# Altium schematic sheet RXMIX-T3.SchDoc
size Legal; CompanyName: Brinton Engineering, LLC; Address1: 3479 Edison Way; Address2: Menlo Park CA 94025; Address3: +1 (877) 778-8435; Address4: brintonengineering.com; Revision: 1; SheetNumber: 1; SheetTotal: 1
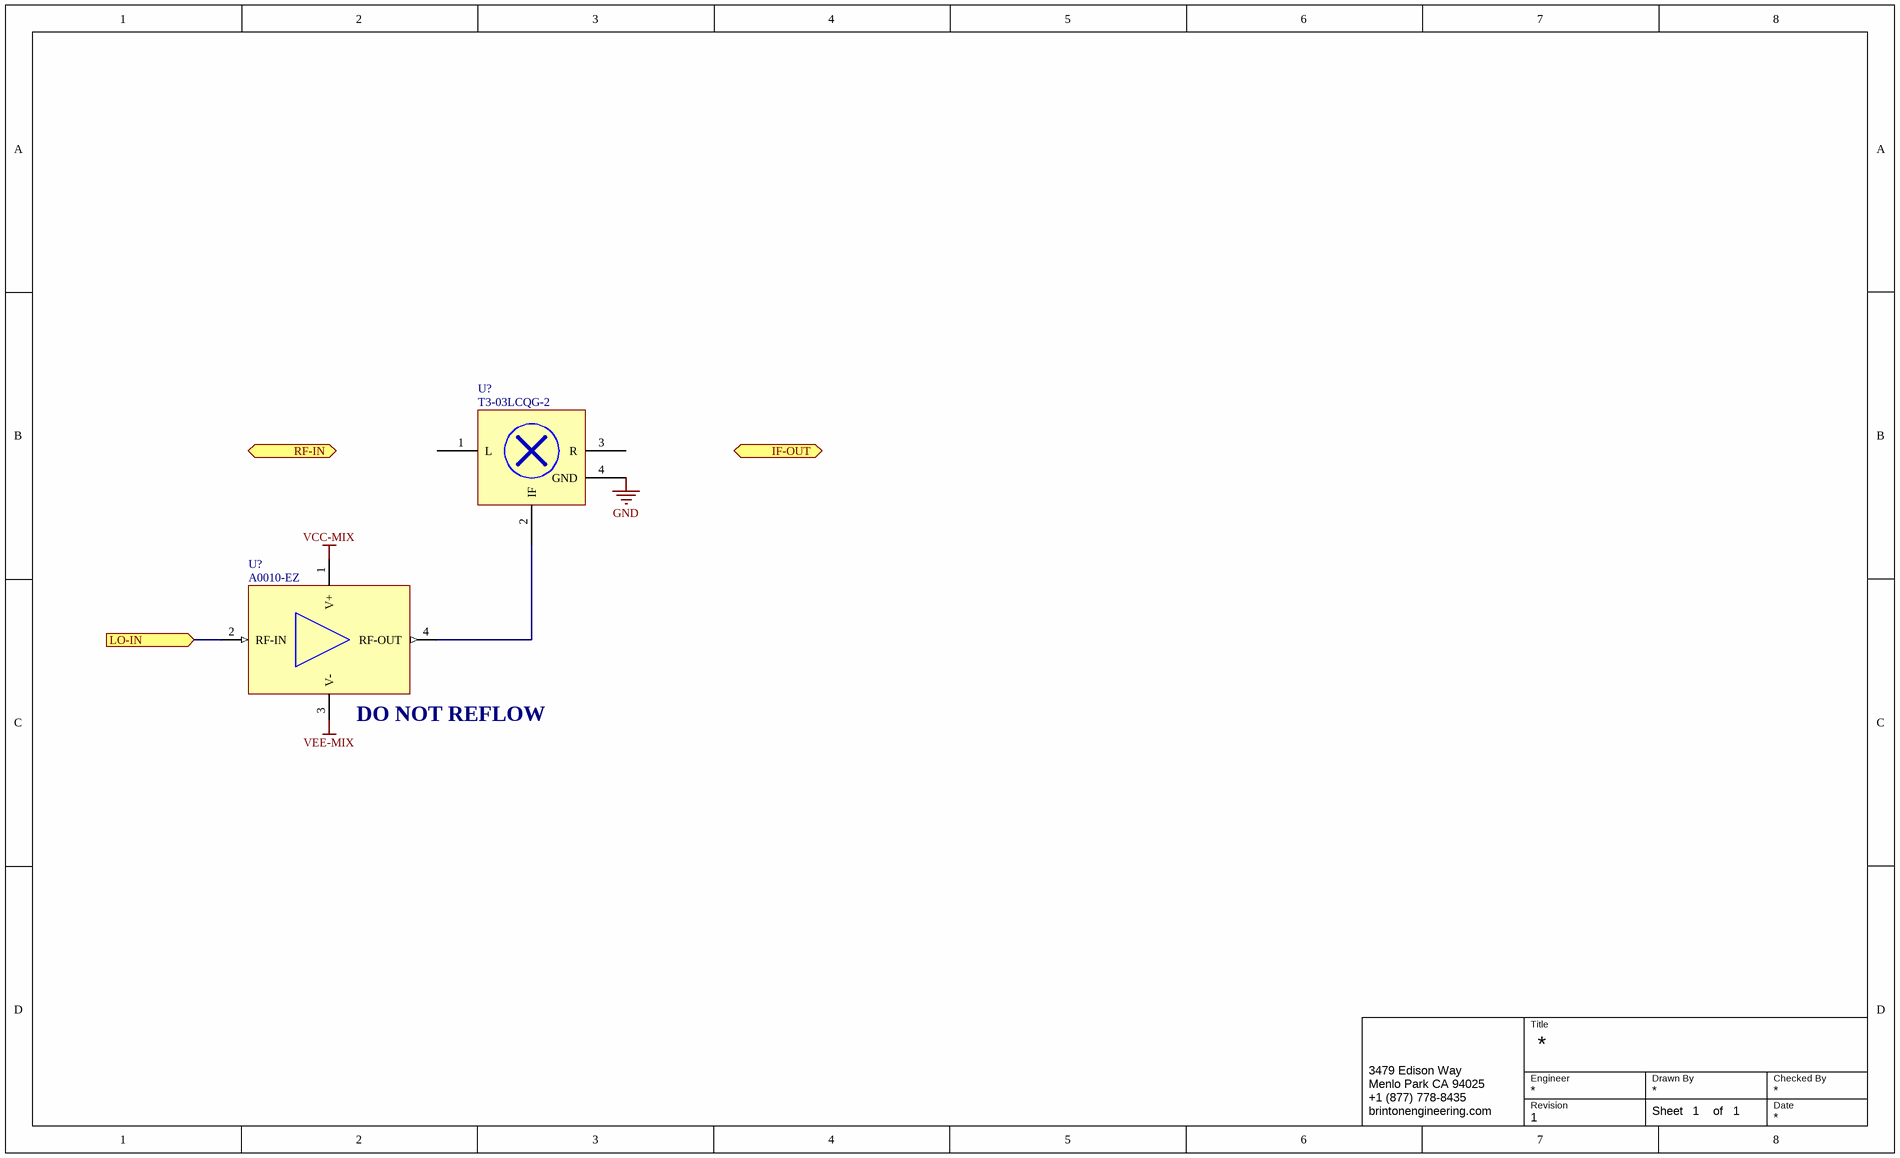
[diagram p0: RXMIX-T3.SchDoc]

## Parts
T3-03LCQG-2  U?  [MARKI-CQG]
U?  DO NOT REFLOW  [MARKI-EZ]

## Ports
IF-OUT (out), LO-IN (in), RF-IN (in)

## Nets
GND: T3-03LCQG-2.4(GND)
VCC-MIX: U?.1(V+)
VEE-MIX: U?.3(V-)
LO-IN: U?.2(RF-IN) ; port LO-IN
NetT3-03LCQG-2_2: T3-03LCQG-2.2(IF) U?.4(RF-OUT)

Not connected (* = marked no-connect by the designer): T3-03LCQG-2 1(L) 3(R)

## Notes on the sheet
- Title
- Engineer
- Revision
- Drawn By
- Checked By
- Date
- Sheet
- of

## Library data of the parts
T3-03LCQG-2 = T3-03LCQG-2: High Linearity Mixer, 1MHz-3.4GHz; Manufacturer: Marki Microwave; Manufacturer P/N: T3-03LCQG-2
U? = A0010-EZ: Square-Wave LO Amplifier; Manufacturer: Marki Microwave; Manufacturer P/N: A0010-EZ